# EAGLE schematic analog (EAGLE 6.3)
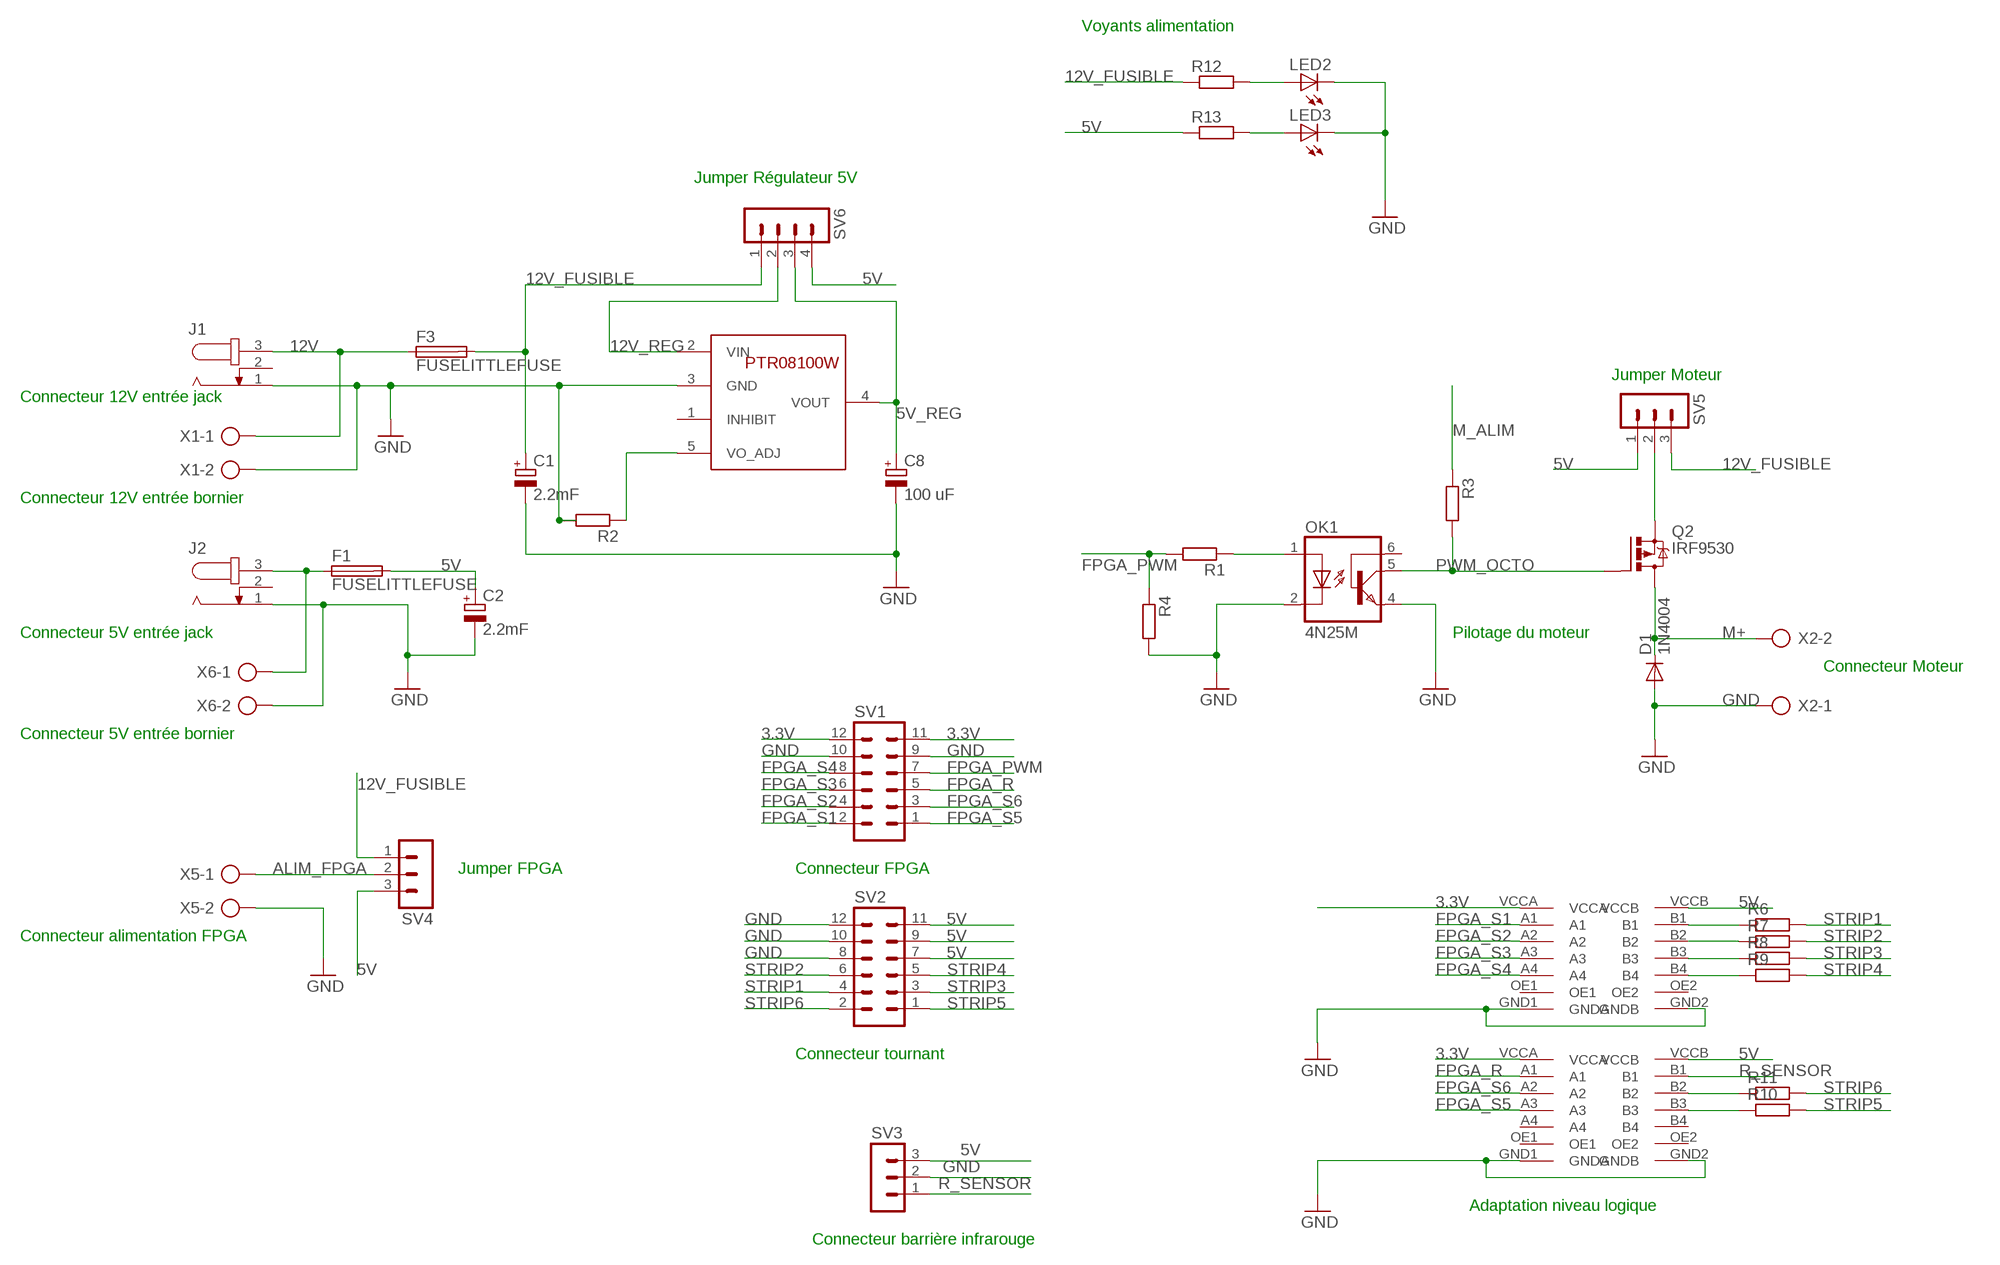
[diagram p0: schematic, sheet 1]

## Parts
C1  2.2mF  CPOL-EUE7.5-16  [E7,5-16]
C2  2.2mF  CPOL-EUE7.5-16  [E7,5-16]
C8  100 uF  CPOL-EUE2.5-7  [E2,5-7]
D1  1N4004  [DO41-10]
F1  FUSELITTLEFUSE  [LITTLEFUSE]
F3  FUSELITTLEFUSE  [LITTLEFUSE]
J1  JACK-PLUG1  [SPC4078]
J2  JACK-PLUG1  [SPC4078]
LED2  LED5MM  [LED5MM]
LED3  LED5MM  [LED5MM]
OK1  4N25M  [DIL06]
Q2  IRF9530  [TO220BV]
R1  R-EU_0207/10  [0207/10]
R2  R-EU_0207/10  [0207/10]
R3  R-EU_0207/10  [0207/10]
R4  R-EU_0207/10  [0207/10]
R6  R-EU_0207/10  [0207/10]
R7  R-EU_0207/10  [0207/10]
R8  R-EU_0207/10  [0207/10]
R9  R-EU_0207/10  [0207/10]
R10  R-EU_0207/10  [0207/10]
R11  R-EU_0207/10  [0207/10]
R12  R-EU_0207/10  [0207/10]
R13  R-EU_0207/10  [0207/10]
SV1  MA06-2  [MA06-2]
SV2  MA06-2  [MA06-2]
SV3  MA03-1  [MA03-1]
SV4  MA03-1  [MA03-1]
SV5  MA03-1  [MA03-1]
SV6  MA04-1  [MA04-1]
U2  PTR08100W  [PTR08100W]
U$1  TXB0104  [TXB0104]
U$2  TXB0104  [TXB0104]
X1  AK500/2  [AK500/2]
X2  AK500/2  [AK500/2]
X5  AK500/2  [AK500/2]
X6  AK500/2  [AK500/2]

## Nets
3.3V: SV1.11 SV1.12 U$1.VCCA U$2.VCCA
5V: C2.+ F1.2 R13.1 SV2.7 SV2.9 SV2.11 SV3.3 SV4.3 SV5.1 SV6.4 U$1.VCCB U$2.VCCB
5V_IN: F1.1 J2.3 X6.1
5V_REG: C8.+ SV6.3 U2.4(VOUT)
12V: F3.1 J1.3 X1.1
12V_FUSIBLE: C1.+ F3.2 R12.1 SV4.1 SV5.3 SV6.1
12V_REG: SV6.2 U2.2(VIN)
ALIM_FPGA: SV4.2 X5.1
FPGA_PWM: R1.2 R4.1 SV1.7
FPGA_R: SV1.5 U$2.A1
FPGA_S1: SV1.2 U$1.A1
FPGA_S2: SV1.4 U$1.A2
FPGA_S3: SV1.6 U$1.A3
FPGA_S4: SV1.8 U$1.A4
FPGA_S5: SV1.1 U$2.A3
FPGA_S6: SV1.3 U$2.A2
GND: C1.- C2.- C8.- D1.A J1.1 J2.1 LED2.K(C) LED3.K(C) OK1.2(C) OK1.4(EMI) R2.2 R4.2 SV1.9 SV1.10 SV2.8 SV2.10 SV2.12 SV3.2 U2.3(GND) U$1.GND1(GNDA) U$1.GND2(GNDB) U$2.GND1(GNDA) U$2.GND2(GNDB) X1.2 X2.1 X5.2 X6.2
M+: D1.C Q2.D X2.2
M_ALIM: Q2.S R3.1 SV5.2
N$9: LED2.A R12.2
N$10: LED3.A R13.2
PWM_OCTO: OK1.5(COL) Q2.G R3.2
R_SENSOR: SV3.1 U$2.B1
R_STRIP_1: R6.1 U$1.B1
R_STRIP_2: R7.1 U$1.B2
R_STRIP_3: R8.1 U$1.B3
R_STRIP_4: R9.1 U$1.B4
R_STRIP_5: R10.1 U$2.B3
R_STRIP_6: R11.1 U$2.B2
RES_OCTO: OK1.1(A) R1.1
STRIP1: R6.2 SV2.4
STRIP2: R7.2 SV2.6
STRIP3: R8.2 SV2.3
STRIP4: R9.2 SV2.5
STRIP5: R10.2 SV2.1
STRIP6: R11.2 SV2.2
VO_ADJ: R2.1 U2.5(VO_ADJ)
Unconnected: J1.2 J2.2 OK1.6(BAS) U2.1(INHIBIT) U$1.OE1 U$1.OE2 U$2.A4 U$2.B4 U$2.OE1 U$2.OE2

## Notes on the sheet
- Voyants alimentation
- Jumper Régulateur 5V
- Jumper Moteur
- Connecteur 12V entrée jack
- Connecteur 12V entrée bornier
- Connecteur 5V entrée jack | Pilotage du moteur
- Connecteur Moteur
- Connecteur 5V entrée bornier
- Jumper FPGA | Connecteur FPGA
- Connecteur alimentation FPGA
- Connecteur tournant
- Adaptation niveau logique
- Connecteur barrière infrarouge

## Library data of the parts
C1 C2 C8 = rcl:CPOL-EU: POLARIZED CAPACITOR, European symbol
D1 = diode:1N4004: DIODE general purpose rectifier, 1 A
F1 F3 = fuse:FUSE: Fuse; OC_FARNELL: unknown; OC_NEWARK: unknown
J1 J2 = con-jack:JACK-PLUG: DC POWER JACK Power Jack, DC, Right Angle, Through Hole, Rated 5A at 16VDC, PC Terminals Distributor: Farnell (www.Farnell.de) Drawing: 84N1161.pdf / 84N1162.pdf Manufacturer: SPC Technology (www.spctechnology.com) Type: SPC4077 / SPC 4078; OC_FARNELL: unknown; OC_NEWARK: unknown
LED2 LED3 = led:LED: LED OSRAM: - CHIPLED LG R971, LG N971, LY N971, LG Q971, LY Q971, LO R971, LY R971 LH N974, LH R974 LS Q976, LO Q976, LY Q976 LO Q996 - Hyper CHIPLED LW Q18S LB Q993, LB Q99A, LB R99A - SideLED LS A670, LO A670, LY A670, LG A670, LP A670 LB A673, LV A673, LT A673, LW A673 LH A674 LY A675 LS A676, LA A676, LO A676, LY A676, LW A676 LS A679, LY A679, LG A679 - Hyper Micro SIDELED® LS Y876, LA Y876, LO Y876, LY Y876 LT Y87S - SmartLED LW L88C, LW L88S LB L89C, LB L89S, LG L890 LS L89K, LO L89K, LY L89K LS L896, LA L896, LO L896, LY L896 - TOPLED LS T670, LO T670, LY T670, LG T670, LP T670 LSG T670, LSP T670, LSY T670, LOP T670, LYG T670 LG T671, LOG T671, LSG T671 LB T673, LV T673, LT T673, LW T673 LH T674 LS T676, LA T676, LO T676, LY T676, LB T676, LH T676, LSB T676, LW T676 LB T67C, LV T67C, LT T67C, LS T67K, LO T67K, LY T67K, LW E67C LS E67B, LA E67B, LO E67B, LY E67B, LB E67C, LV E67C, LT E67C LW T67C LS T679, LY T679, LG T679 LS T770, LO T770, LY T770, LG T770, LP T770 LB T773, LV T773, LT T773, LW T773 LH T774 LS E675, LA E675, LY E675, LS T675 LS T776, LA T776, LO T776, LY T776, LB T776 LHGB T686 LT T68C, LB T68C - Hyper Mini TOPLED® LB M676 - Mini TOPLED Santana® LG M470 LS M47K, LO M47K, LY M47K Source: http://www.osram.convergy.de LUXEON: - LUMILED® LXK2-PW12-R00, LXK2-PW12-S00, LXK2-PW14-U00, LXK2-PW14-V00 LXK2-PM12-R00, LXK2-PM12-S00, LXK2-PM14-U00 LXK2-PE12-Q00, LXK2-PE12-R00, LXK2-PE12-S00, LXK2-PE14-T00, LXK2-PE14-U00 LXK2-PB12-K00, LXK2-PB12-L00, LXK2-PB12-M00, LXK2-PB14-N00, LXK2-PB14-P00, LXK2-PB14-Q00 LXK2-PR12-L00, LXK2-PR12-M00, LXK2-PR14-Q00, LXK2-PR14-R00 LXK2-PD12-Q00, LXK2-PD12-R00, LXK2-PD12-S00 LXK2-PH12-R00, LXK2-PH12-S00 LXK2-PL12-P00, LXK2-PL12-Q00, LXK2-PL12-R00 Source: www.luxeon.com KINGBRIGHT: KA-3528ASYC Source: www.kingbright.com
OK1 = optocoupler:4N*?M: General Purpose 6-Pin Phototransistor Optocouplers Source: http://www.fairchildsemi.com/ds/4N/4N35-M.pdf; MPN: 4N25-M; OC_FARNELL: 1021349; OC_NEWARK: 98K9084
Q2 = transistor-power:IRF9530: P-CHANNEL HEXFET POWER-MOS-FET Source: http://www.irf.com/product-info/datasheets/data/irf9530.pdf
R1-R4 R6-R13 = rcl:R-EU_: RESISTOR, European symbol
SV1 SV2 = con-lstb:MA06-2: PIN HEADER; OC_FARNELL: unknown; OC_NEWARK: unknown
SV3-SV5 = con-lstb:MA03-1: PIN HEADER; OC_FARNELL: unknown; OC_NEWARK: unknown
SV6 = con-lstb:MA04-1: PIN HEADER; OC_FARNELL: unknown; OC_NEWARK: unknown
U2 = perso:PTR08100W
U$1 U$2 = perso:TXB0104
X1 X2 X5 X6 = con-ptr500:AK500/2: CONNECTOR; OC_FARNELL: unknown; OC_NEWARK: unknown